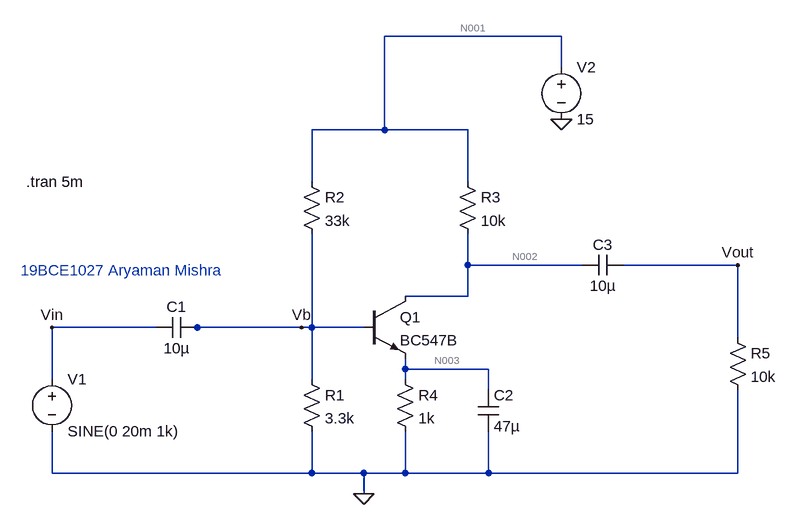
[diagram p0: schematic Draft3 (1).asc]
Draft3 (1).asc, the LTspice schematic file:
Version 4
SHEET 1 1316 680
WIRE 976 -352 704 -352
WIRE 976 -304 976 -352
WIRE 704 -208 704 -352
WIRE 704 -208 592 -208
WIRE 832 -208 704 -208
WIRE 592 -128 592 -208
WIRE 832 -128 832 -208
WIRE 832 0 832 -48
WIRE 1008 0 832 0
WIRE 1248 0 1072 0
WIRE 832 48 832 0
WIRE 832 48 736 48
WIRE 352 96 192 96
WIRE 416 96 400 96
WIRE 576 96 416 96
WIRE 592 96 592 -48
WIRE 592 96 576 96
WIRE 672 96 592 96
WIRE 1248 112 1248 0
WIRE 736 160 736 144
WIRE 864 160 736 160
WIRE 192 176 192 96
WIRE 592 176 592 96
WIRE 736 176 736 160
WIRE 864 192 864 160
WIRE 192 320 192 256
WIRE 592 320 592 256
WIRE 592 320 192 320
WIRE 672 320 592 320
WIRE 736 320 736 256
WIRE 736 320 672 320
WIRE 864 320 864 256
WIRE 864 320 736 320
WIRE 1248 320 1248 192
WIRE 1248 320 864 320
WIRE 672 352 672 320
FLAG 192 96 Vin
FLAG 576 96 Vb
FLAG 976 -224 0
FLAG 672 352 0
FLAG 1248 0 Vout
SYMBOL voltage 192 160 R0
WINDOW 123 0 0 Left 0
WINDOW 39 0 0 Left 0
SYMATTR InstName V1
SYMATTR Value SINE(0 20m 1k)
SYMBOL cap 416 80 R90
WINDOW 0 0 32 VBottom 2
WINDOW 3 32 32 VTop 2
SYMATTR InstName C1
SYMATTR Value 10µ
SYMBOL res 576 160 R0
SYMATTR InstName R1
SYMATTR Value 3.3k
SYMBOL res 576 -144 R0
SYMATTR InstName R2
SYMATTR Value 33k
SYMBOL res 816 -144 R0
SYMATTR InstName R3
SYMATTR Value 10k
SYMBOL npn 672 48 R0
SYMATTR InstName Q1
SYMATTR Value BC547B
SYMBOL voltage 976 -320 R0
WINDOW 123 0 0 Left 0
WINDOW 39 0 0 Left 0
SYMATTR InstName V2
SYMATTR Value 15
SYMBOL res 720 160 R0
SYMATTR InstName R4
SYMATTR Value 1k
SYMBOL cap 848 192 R0
SYMATTR InstName C2
SYMATTR Value 47µ
SYMBOL cap 1072 -16 R90
WINDOW 0 0 32 VBottom 2
WINDOW 3 32 32 VTop 2
SYMATTR InstName C3
SYMATTR Value 10µ
SYMBOL res 1232 96 R0
SYMATTR InstName R5
SYMATTR Value 10k
TEXT 144 8 Left 2 ;19BCE1027 Aryaman Mishra
TEXT 152 -128 Left 2 !.tran 5m

The netlist it stands for:
* Draft3 (1).asc
V1 Vin 0 SINE(0 20m 1k)
C1 Vb Vin 10µ
R1 Vb 0 3.3k
R2 N001 Vb 33k
R3 N001 N002 10k
Q1 N002 Vb N003 0 BC547B
V2 N001 0 15
R4 N003 0 1k
C2 N003 0 47µ
C3 Vout N002 10µ
R5 Vout 0 10k
.model NPN NPN
.model PNP PNP
.lib standard.bjt
* 19BCE1027 Aryaman Mishra
.tran 5m
.backanno
.end

* Results of the author's LTspice run, read from the files saved beside the schematic
* Operating Point, zero values left out:
*   V(vb) = 1.357 V
*   V(n001) = 15 V
*   V(n002) = 7.735 V
*   V(n003) = 728.8 mV
*   Ic(Q1) = 726.5 µA
*   Ib(Q1) = 2.328 µA
*   Ie(Q1) = -728.8 µA
*   I(R4) = 728.8 µA
*   I(R3) = 726.5 µA
*   I(R2) = 413.4 µA
*   I(R1) = 411.1 µA
*   I(V2) = -1.14 mA
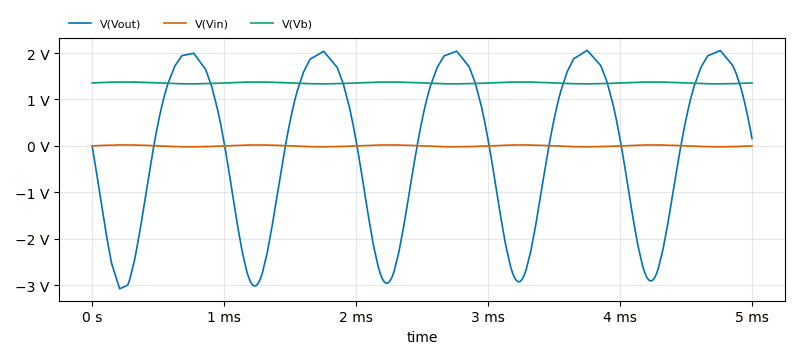
[diagram p1: Transient Analysis of Draft3 (1).asc, plotted from the saved traces]
* Transient Analysis, 1 run:
*   V(Vout): min -3.079 V, max 2.059 V, average -72.38 mV, rms 1.773 V, last 156.5 mV
*   V(Vin): min -19.98 mV, max 20 mV, average 112.8 µV, rms 14.01 mV, last 0 V
*   V(Vb): min 1.337 V, max 1.376 V, average 1.357 V, rms 1.357 V, last 1.357 V